# Altium project PCB_ECG.PrjPcb
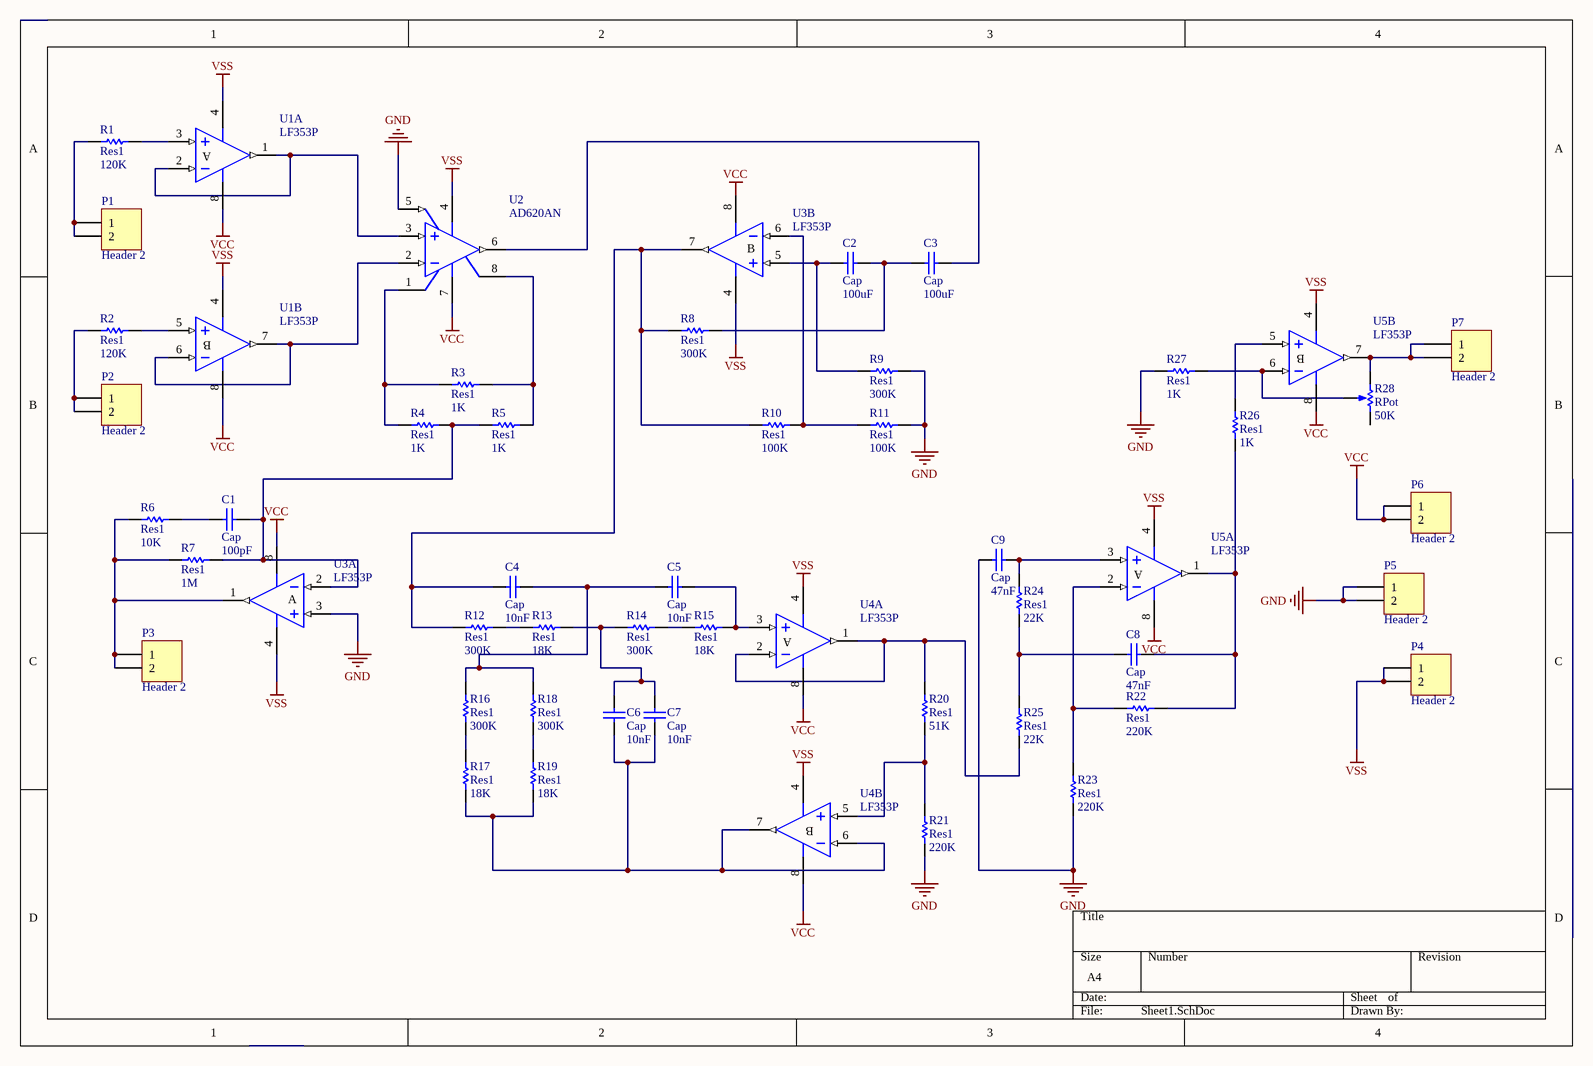
[diagram p0: Sheet1.SchDoc]
2 sheets, 49 parts. Net scope: global (net labels, ports and power ports of the same name join across sheets).
Board file: PCB1.PcbDoc
Sheets:
  Sheet1.SchDoc
  Sheet2.SchDoc

## Sheet Sheet1.SchDoc
size A4

### Parts
C1  Cap  value 100pF  [RAD-0.3]
C2  Cap  value 100uF  [RAD-0.3]
C3  Cap  value 100uF  [RAD-0.3]
C4  Cap  value 10nF  [RAD-0.3]
C5  Cap  value 10nF  [RAD-0.3]
C6  Cap  value 10nF  [RAD-0.3]
C7  Cap  value 10nF  [RAD-0.3]
C8  Cap  value 47nF  [RAD-0.3]
C9  Cap  value 47nF  [RAD-0.3]
P1  Header 2  [HDR1X2]
P2  Header 2  [HDR1X2]
P3  Header 2  [HDR1X2]
P4  Header 2  [HDR1X2]
P5  Header 2  [HDR1X2]
P6  Header 2  [HDR1X2]
P7  Header 2  [HDR1X2]
R1  Res1  value 120K  [AXIAL-0.3]
R2  Res1  value 120K  [AXIAL-0.3]
R3  Res1  value 1K  [AXIAL-0.3]
R4  Res1  value 1K  [AXIAL-0.3]
R5  Res1  value 1K  [AXIAL-0.3]
R6  Res1  value 10K  [AXIAL-0.3]
R7  Res1  value 1M  [AXIAL-0.3]
R8  Res1  value 300K  [AXIAL-0.3]
R9  Res1  value 300K  [AXIAL-0.3]
R10  Res1  value 100K  [AXIAL-0.3]
R11  Res1  value 100K  [AXIAL-0.3]
R12  Res1  value 300K  [AXIAL-0.3]
R13  Res1  value 18K  [AXIAL-0.3]
R14  Res1  value 300K  [AXIAL-0.3]
R15  Res1  value 18K  [AXIAL-0.3]
R16  Res1  value 300K  [AXIAL-0.3]
R17  Res1  value 18K  [AXIAL-0.3]
R18  Res1  value 300K  [AXIAL-0.3]
R19  Res1  value 18K  [AXIAL-0.3]
R20  Res1  value 51K  [AXIAL-0.3]
R21  Res1  value 220K  [AXIAL-0.3]
R22  Res1  value 220K  [AXIAL-0.3]
R23  Res1  value 220K  [AXIAL-0.3]
R24  Res1  value 22K  [AXIAL-0.3]
R25  Res1  value 22K  [AXIAL-0.3]
R26  Res1  value 1K  [AXIAL-0.3]
R27  Res1  value 1K  [AXIAL-0.3]
R28  RPot  value 50K  [VR5]
U1  LF353P  [P008]  (parts A,B of 2)
U2  AD620AN  [N-8]
U3  LF353P  [P008]  (parts A,B of 2)
U4  LF353P  [P008]  (parts A,B of 2)
U5  LF353P  [P008]  (parts A,B of 2)

### Nets
GND: C9.1 P5.1 P5.2 R9.2 R11.2 R21.1 R23.1 R27.1 U2.5(REF) U3.3(IN+)
VCC: P6.1 P6.2 U1.8(V+) U2.7(V+) U3.8(V+) U4.8(V+) U5.8(V+)
VSS: P4.1 P4.2 U1.4(V-) U2.4(V-) U3.4(V-) U4.4(V-) U5.4(V-)
NetC1_1: C1.1 R6.2
NetC1_2: C1.2 R4.2 R5.1 R7.2 U3.2(IN-)
NetC2_1: C2.1 R9.1 U3.5(IN+)
NetC2_2: C2.2 C3.1 R8.2
NetC3_2: C3.2 U2.6(OUT)
NetC4_1: C4.1 R8.1 R10.1 R12.1 U3.7(OUT)
NetC4_2: C4.2 C5.1 R16.2 R18.2
NetC5_2: C5.2 R15.2 U4.3(IN+)
NetC6_1: C6.1 C7.1 R17.1 R19.1 U4.6(IN-) U4.7(OUT)
NetC6_2: C6.2 C7.2 R13.2 R14.1
NetC8_1: C8.1 R24.1 R25.2
NetC8_2: C8.2 R22.2 R26.1 U5.1(OUT)
NetC9_2: C9.2 R24.2 U5.3(IN+)
NetP1_1: P1.1 P1.2 R1.1
NetP2_1: P2.1 P2.2 R2.1
NetP3_1: P3.1 P3.2 R6.1 R7.1 U3.1(OUT)
NetP7_1: P7.1 P7.2 R28.1(TOP) U5.7(OUT)
NetR1_2: R1.2 U1.3(IN+)
NetR2_2: R2.2 U1.5(IN+)
NetR3_1: R3.1 R4.1 U2.1(RG)
NetR3_2: R3.2 R5.2 U2.8(RG)
NetR10_2: R10.2 R11.1 U3.6(IN-)
NetR12_2: R12.2 R13.1
NetR14_2: R14.2 R15.1
NetR16_1: R16.1 R17.2
NetR18_1: R18.1 R19.2
NetR20_1: R20.1 R21.2 U4.5(IN+)
NetR20_2: R20.2 R25.1 U4.1(OUT) U4.2(IN-)
NetR22_1: R22.1 R23.2 U5.2(IN-)
NetR26_2: R26.2 U5.5(IN+)
NetR27_2: R27.2 R28.3(TAP) U5.6(IN-)
NetU1_1: U1.1(OUT) U1.2(IN-) U2.3(+IN)
NetU1_6: U1.6(IN-) U1.7(OUT) U2.2(-IN)

Not connected (* = marked no-connect by the designer): R28 2(BOT)

### Notes on the sheet
- (in symbol LF353P, part A) A
- (in symbol LF353P, part B) B

### Library data of the parts
C1-C9 = Cap: Capacitor; Published: 8-Jun-2000; LatestRevisionDate: 17-Jul-2002; LatestRevisionNote: Re-released for DXP Platform.; PackageReference: RAD-0.3; Publisher: Altium Limited; PackageDescription: Radial Cap, Thru-Hole; 2 Leads; 0.3 in Pin Spacing
P1-P7 = Header 2: Header, 2-Pin; LatestRevisionDate: 17-Jul-2002; LatestRevisionNote: Re-released for DXP Platform.; Publisher: Altium Limited
R1-R27 = Res1: Resistor; Published: 8-Jun-2000; LatestRevisionDate: 17-Jul-2002; LatestRevisionNote: Re-released for DXP Platform.; PackageReference: AXIAL-0.3; Publisher: Altium Limited; PackageDescription: Axial Device, Thru-Hole; 2 Leads; 0.3 in Pin Spacing
R28 = RPot: Potentiometer; Sim Note: Enter the Resistance value and the set point into parameter fields.; Set Position: 0.5; Published: 8-Jun-2000; LatestRevisionDate: 17-Jul-2002; LatestRevisionNote: Re-released for DXP Platform.; PackageReference: VR5; Publisher: Altium Limited; PackageDescription: Variable Resistor, Thru-Hole; 3 Leads
U1 U3-U5 = LF353P: Dual Operational Amplifier; Published: 16-Jan-2001; LatestRevisionDate: 04-Mar-2005; LatestRevisionNote: Stylized 3D Model Added.; DatasheetVersion: Aug-1994; PackageVersion: Jun-1999; PackageReference: P008; Publisher: Altium Limited; PackageDescription: DIP; 8 Leads; Row Spacing 7.62 mm; Pitch 2.54 mm; Code_JEDEC: MO-001-AN; ComponentLink1Description: Manufacturer Link; ComponentLink1URL: http://www.ti.com/; ComponentLink2Description: Datasheet; ComponentLink2URL: http://www-s.ti.com/sc/ds/lf353.pdf
U2 = AD620AN: Low-Cost, Low-Power Instrumentation Amplifier; Published: 8-Jun-2000; LatestRevisionDate: 04-Mar-2005; LatestRevisionNote: Stylized 3D Model Added.; DatasheetVersion: REV.D 1998; PackageVersion: revA; PackageReference: N-8; Publisher: Altium Limited; PackageDescription: DIP; 8 Leads; Row Spacing 7.62 mm; Pitch 2.54 mm; ComponentLink1Description: Manufacturer Link; ComponentLink1URL: http://www.analog.com/en/prod/0%2C2877%2CAD620%2C00.html; ComponentLink2Description: Datasheet; ComponentLink2URL: http://www.analog.com/UploadedFiles/Data_Sheets/897653854AD620_g.pdf

## Sheet Sheet2.SchDoc
size A4